# Altium schematic sheet audio_out.SchDoc
size 420 x 297 mm; DocumentNumber: Audio output
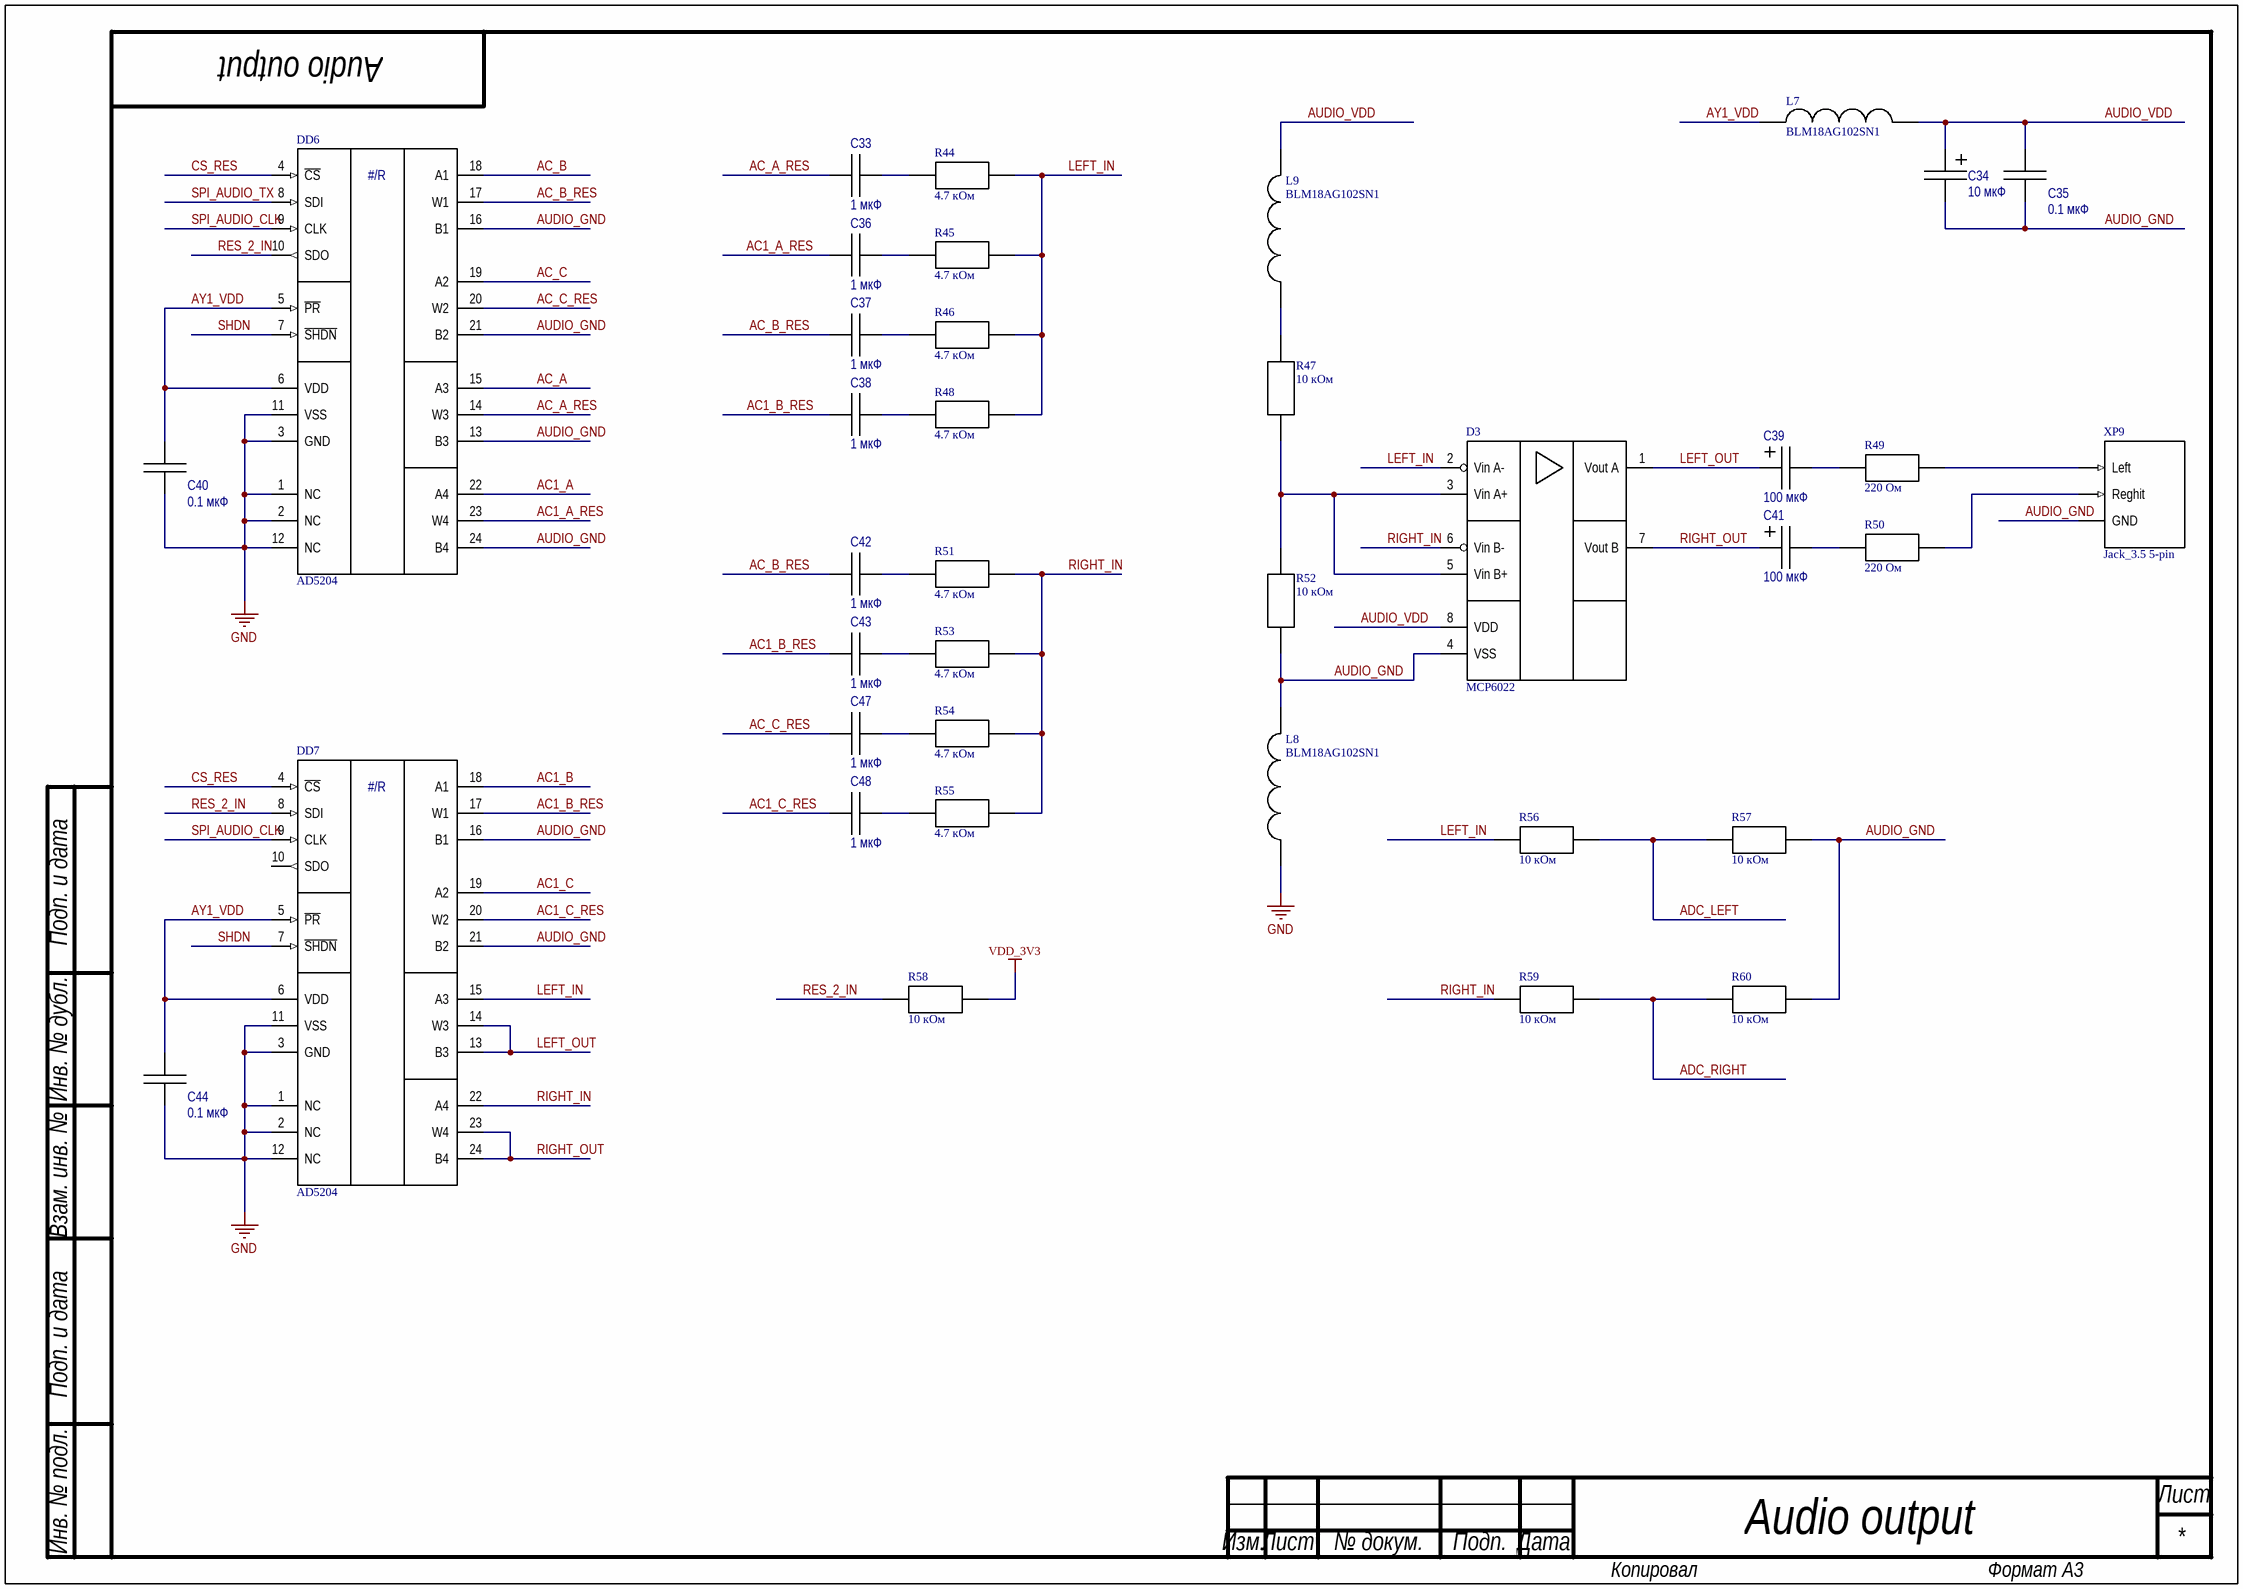
[diagram p0: audio_out.SchDoc]

## Parts
C33  1 мкФ  [C 1206]
C34  10 мкФ  [C TAN_C]
C35  0.1 мкФ  [C 1206]
C36  1 мкФ  [C 1206]
C37  1 мкФ  [C 1206]
C38  1 мкФ  [C 1206]
C39  100 мкФ  [C TAN_D]
C40  0.1 мкФ  [C 1206]
C41  100 мкФ  [C TAN_D]
C42  1 мкФ  [C 1206]
C43  1 мкФ  [C 1206]
C44  0.1 мкФ  [C 1206]
C47  1 мкФ  [C 1206]
C48  1 мкФ  [C 1206]
D3  MCP6022  [SOIC-8]
DD6  AD5204  [TSSOP-24]
DD7  AD5204  [TSSOP-24]
L7  BLM18AG102SN1  [FB 0603]
L8  BLM18AG102SN1  [FB 0603]
L9  BLM18AG102SN1  [FB 0603]
R44  4.7 кОм  [RES 0805]
R45  4.7 кОм  [RES 0805]
R46  4.7 кОм  [RES 0805]
R47  10 кОм  [RES 0805]
R48  4.7 кОм  [RES 0805]
R49  220 Ом  [RES 0805]
R50  220 Ом  [RES 0805]
R51  4.7 кОм  [RES 0805]
R52  10 кОм  [RES 0805]
R53  4.7 кОм  [RES 0805]
R54  4.7 кОм  [RES 0805]
R55  4.7 кОм  [RES 0805]
R56  10 кОм  [RES 0805]
R57  10 кОм  [RES 0805]
R58  10 кОм  [RES 0805]
R59  10 кОм  [RES 0805]
R60  10 кОм  [RES 0805]
XP9  Jack_3.5 5-pin  [JACK 3.5  female]

## Nets
GND: C40.2 C44.2 DD6.1(NC) DD6.2(NC) DD6.3(GND) DD6.11(VSS) DD6.12(NC) DD7.1(NC) DD7.2(NC) DD7.3(GND) DD7.11(VSS) DD7.12(NC) L8.1
VDD_3V3: R58.2
AC1_A: DD6.22(A4)
AC1_A_RES: C36.1 DD6.23(W4)
AC1_B: DD7.18(A1)
AC1_B_RES: C38.1 C43.1 DD7.17(W1)
AC1_C: DD7.19(A2)
AC1_C_RES: C48.1 DD7.20(W2)
AC_A: DD6.15(A3)
AC_A_RES: C33.1 DD6.14(W3)
AC_B: DD6.18(A1)
AC_B_RES: C37.1 C42.1 DD6.17(W1)
AC_C: DD6.19(A2)
AC_C_RES: C47.1 DD6.20(W2)
ADC_LEFT: R56.1 R57.2
ADC_RIGHT: R59.1 R60.2
AUDIO_GND: C34.2 C35.2 D3.4(VSS) DD6.13(B3) DD6.16(B1) DD6.21(B2) DD6.24(B4) DD7.16(B1) DD7.21(B2) L8.2 R52.1 R57.1 R60.1 XP9.G(GND)
AUDIO_VDD: C34.1 C35.1 D3.8(VDD) L7.2 L9.2
AY1_VDD: C40.1 C44.1 DD6.5(~{PR}) DD6.6(VDD) DD7.5(~{PR}) DD7.6(VDD) L7.1
CS_RES: DD6.4(~{CS}) DD7.4(~{CS})
LEFT_IN: D3.2(Vin_A-) DD7.15(A3) R44.2 R45.2 R46.2 R48.2 R56.2
LEFT_OUT: C39.1 D3.1(Vout_A) DD7.13(B3) DD7.14(W3)
RES_2_IN: DD6.10(SDO) DD7.8(SDI) R58.1
RIGHT_IN: D3.6(Vin_B-) DD7.22(A4) R51.2 R53.2 R54.2 R55.2 R59.2
RIGHT_OUT: C41.1 D3.7(Vout_B) DD7.23(W4) DD7.24(B4)
SHDN: DD6.7(~{SHDN}) DD7.7(~{SHDN})
SPI_AUDIO_CLK: DD6.9(CLK) DD7.9(CLK)
SPI_AUDIO_TX: DD6.8(SDI)
NetC33_2: C33.2 R44.1
NetC36_2: C36.2 R45.1
NetC37_2: C37.2 R46.1
NetC38_2: C38.2 R48.1
NetC39_2: C39.2 R49.1
NetC41_2: C41.2 R50.1
NetC42_2: C42.2 R51.1
NetC43_2: C43.2 R53.1
NetC47_2: C47.2 R54.1
NetC48_2: C48.2 R55.1
NetD3_3: D3.3(Vin_A+) D3.5(Vin_B+) R47.1 R52.2
NetL9_1: L9.1 R47.2
NetR49_2: R49.2 XP9.L(Left)
NetR50_2: R50.2 XP9.R(Reghit)

Not connected (* = marked no-connect by the designer): DD7 10(SDO)

## Notes on the sheet
- Подп. и дата
- Инв. № дубл.
- Взам. инв. №
- Инв. № подл.
- Лист
- Изм.
- № докум.
- Подп.
- Дата
- Копировал
- Формат А3
- (in symbol AD5204) #/R

## Library data of the parts
C33 C35-C38 C40 C42-C44 C47 C48 = CAP 1206: SMD Capacitor 1206; Manufacturer: /Укажите компанию-производителя/; Tolerance: /Укажите допуск в процентах/; Temperature coefficient: /Формат: ±? ppm/°C/; Type: Конденсатор керамический; TC: /Укажите тип диэлектрика/; Size: 1206; Temperature range: /Формат: -? ... ? °C/
  C35 C40 C44: Value: 0.1 мкФ
C34 = CAP TAN_C: SMD Tantalium Capacitor C; Manufacturer: /Укажите компанию-производителя/; Tolerance: /Укажите допуск в процентах/; Type: Конденсатор танталовый; ESR: /Укажите значение ЭПС/; Size: C; Temperature range: /Формат: -? ... ? °C/; Value: 10 мкФ
C39 C41 = CAP TAN_D: SMD Tantalium Capacitor D; Manufacturer: /Укажите компанию-производителя/; Tolerance: /Укажите допуск в процентах/; Type: Конденсатор танталовый; ESR: /Укажите значение ЭПС/; Rated voltage: 10 В; Size: D; Temperature range: /Формат: -? ... ? °C/; Value: 100 мкФ
R44-R60 = RES 0805